# Altium schematic sheet ZX-PH2.0-WT4P1_ZX-PH2.0-WT4P.schdoc
size 127 x 99 mm
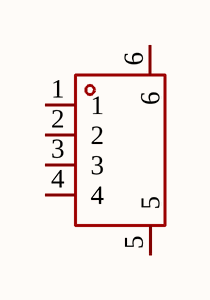
[diagram p0: ZX-PH2.0-WT4P1_ZX-PH2.0-WT4P.schdoc]

## Parts
U?  ZX-PH2.0-WT4P  [CONN-SMD_4P-P2.00_C2001RS10411M0101RC]  (value not drawn)

## Nets

Not connected (* = marked no-connect by the designer): U? 1 2 3 4 5 6

## Library data of the parts
U? = ZX-PH2.0-WT4P: Manufacturer: Megastar(兆星); Add into BOM: yes; Pins Structure: 1x4P; Pitch: 2mm; Reference Series: PH; Number of PINs Per Row: 4; Current Rating (Max): 2A; Symbol: ZX-PH2.0-WT4P; Device: ZX-PH2.0-WT4P; LCSC Part Name: ZX-PH2.0-WT4P; Supplier Part: C7429691; Manufacturer Part: ZX-PH2.0-WT4P; Supplier Footprint: SMD,P=2mm,卧贴; JLCPCB Part Class: Extended Part; Datasheet: https://atta.szlcsc.com/upload/public/pdf/source/20230619/C513FA7515D7082C4F95173A4D7F5060.pdf; Supplier: LCSC; Convert to PCB: yes; Mounting Style: 卧贴; Number of Pins: 4P; Number of Rows: 1; Row Spacing: -; Contact Material: Brass; Contact Plating: Tin; Operating Temperature Range: -25℃~+85℃